# Altium project Sampler_DIOT.PrjPCB (part 2 of 5)

## Sheet EEM_Connectors.SchDoc
size 420 x 297 mm; EDA_Number: ARTIQ; CompanyName: WUT ISE; Organization: WUT ISE; DocumentNumber: 5; SheetNumber: 11; Title2: EEM Connectors, JTAG switches; SPICEModelCacheVGBTAUBO: <root> / <DocumentId>VGBTAUBO</DocumentId> / <CacheFrame Number="0"> / <Model Name="pk14" Kind="CKT"> / <Text>*.INC dhvqfn.s / .SUBCKT pk14 / +    1   2   3   4   5   6   7   8   9  10 / +   11  12  13  14 / +   15  16  17  18  19  20  21  22  23  24 / +   25  26  27  28 / * Pin Resistance / r1 1 1001 9.078E-02 / r2 2 1002 8.829E-02 / r3 3 1003 8.731E-02 / r4 4 1004 8.710E-02 / r5 5 1005 8.731E-02 / r6 6 1006 8.829E-02 / r7 7 1007 9.075E-02 / r8 8 1008 9.072E-02 / r9 9 1009 8.809E-02 / r10 10 1010 8.716E-02 / r11 11 1011 8.706E-02 / r12 12 1012 8.720E-02 / r13 13 1013 8.816E-02 / r14 14 1014 9.068E-02 / * Pin Inductance / l1 1001 15 2.981E-09 / l2 1002 16 2.447E-09 / l3 1003 17 2.304E-09 / l4 1004 18 2.291E-09 / l5 1005 19 2.307E-09 / l6 1006 20 2.449E-09 / l7 1007 21 2.971E-09 / l8 1008 22 2.972E-09 / l9 1009 23 2.425E-09 / l10 1010 24 2.286E-09 / l11 1011 25 2.280E-09 / l12 1012 26 2.286E-09 / l13 1013 27 2.425E-09 / l14 1014 28 2.975E-09 / .ENDS pk14</Text> / </Model> / </CacheFrame> / </root>; ModifiedDate: -; ProjectName: Sampler_DIOT.PrjPCB
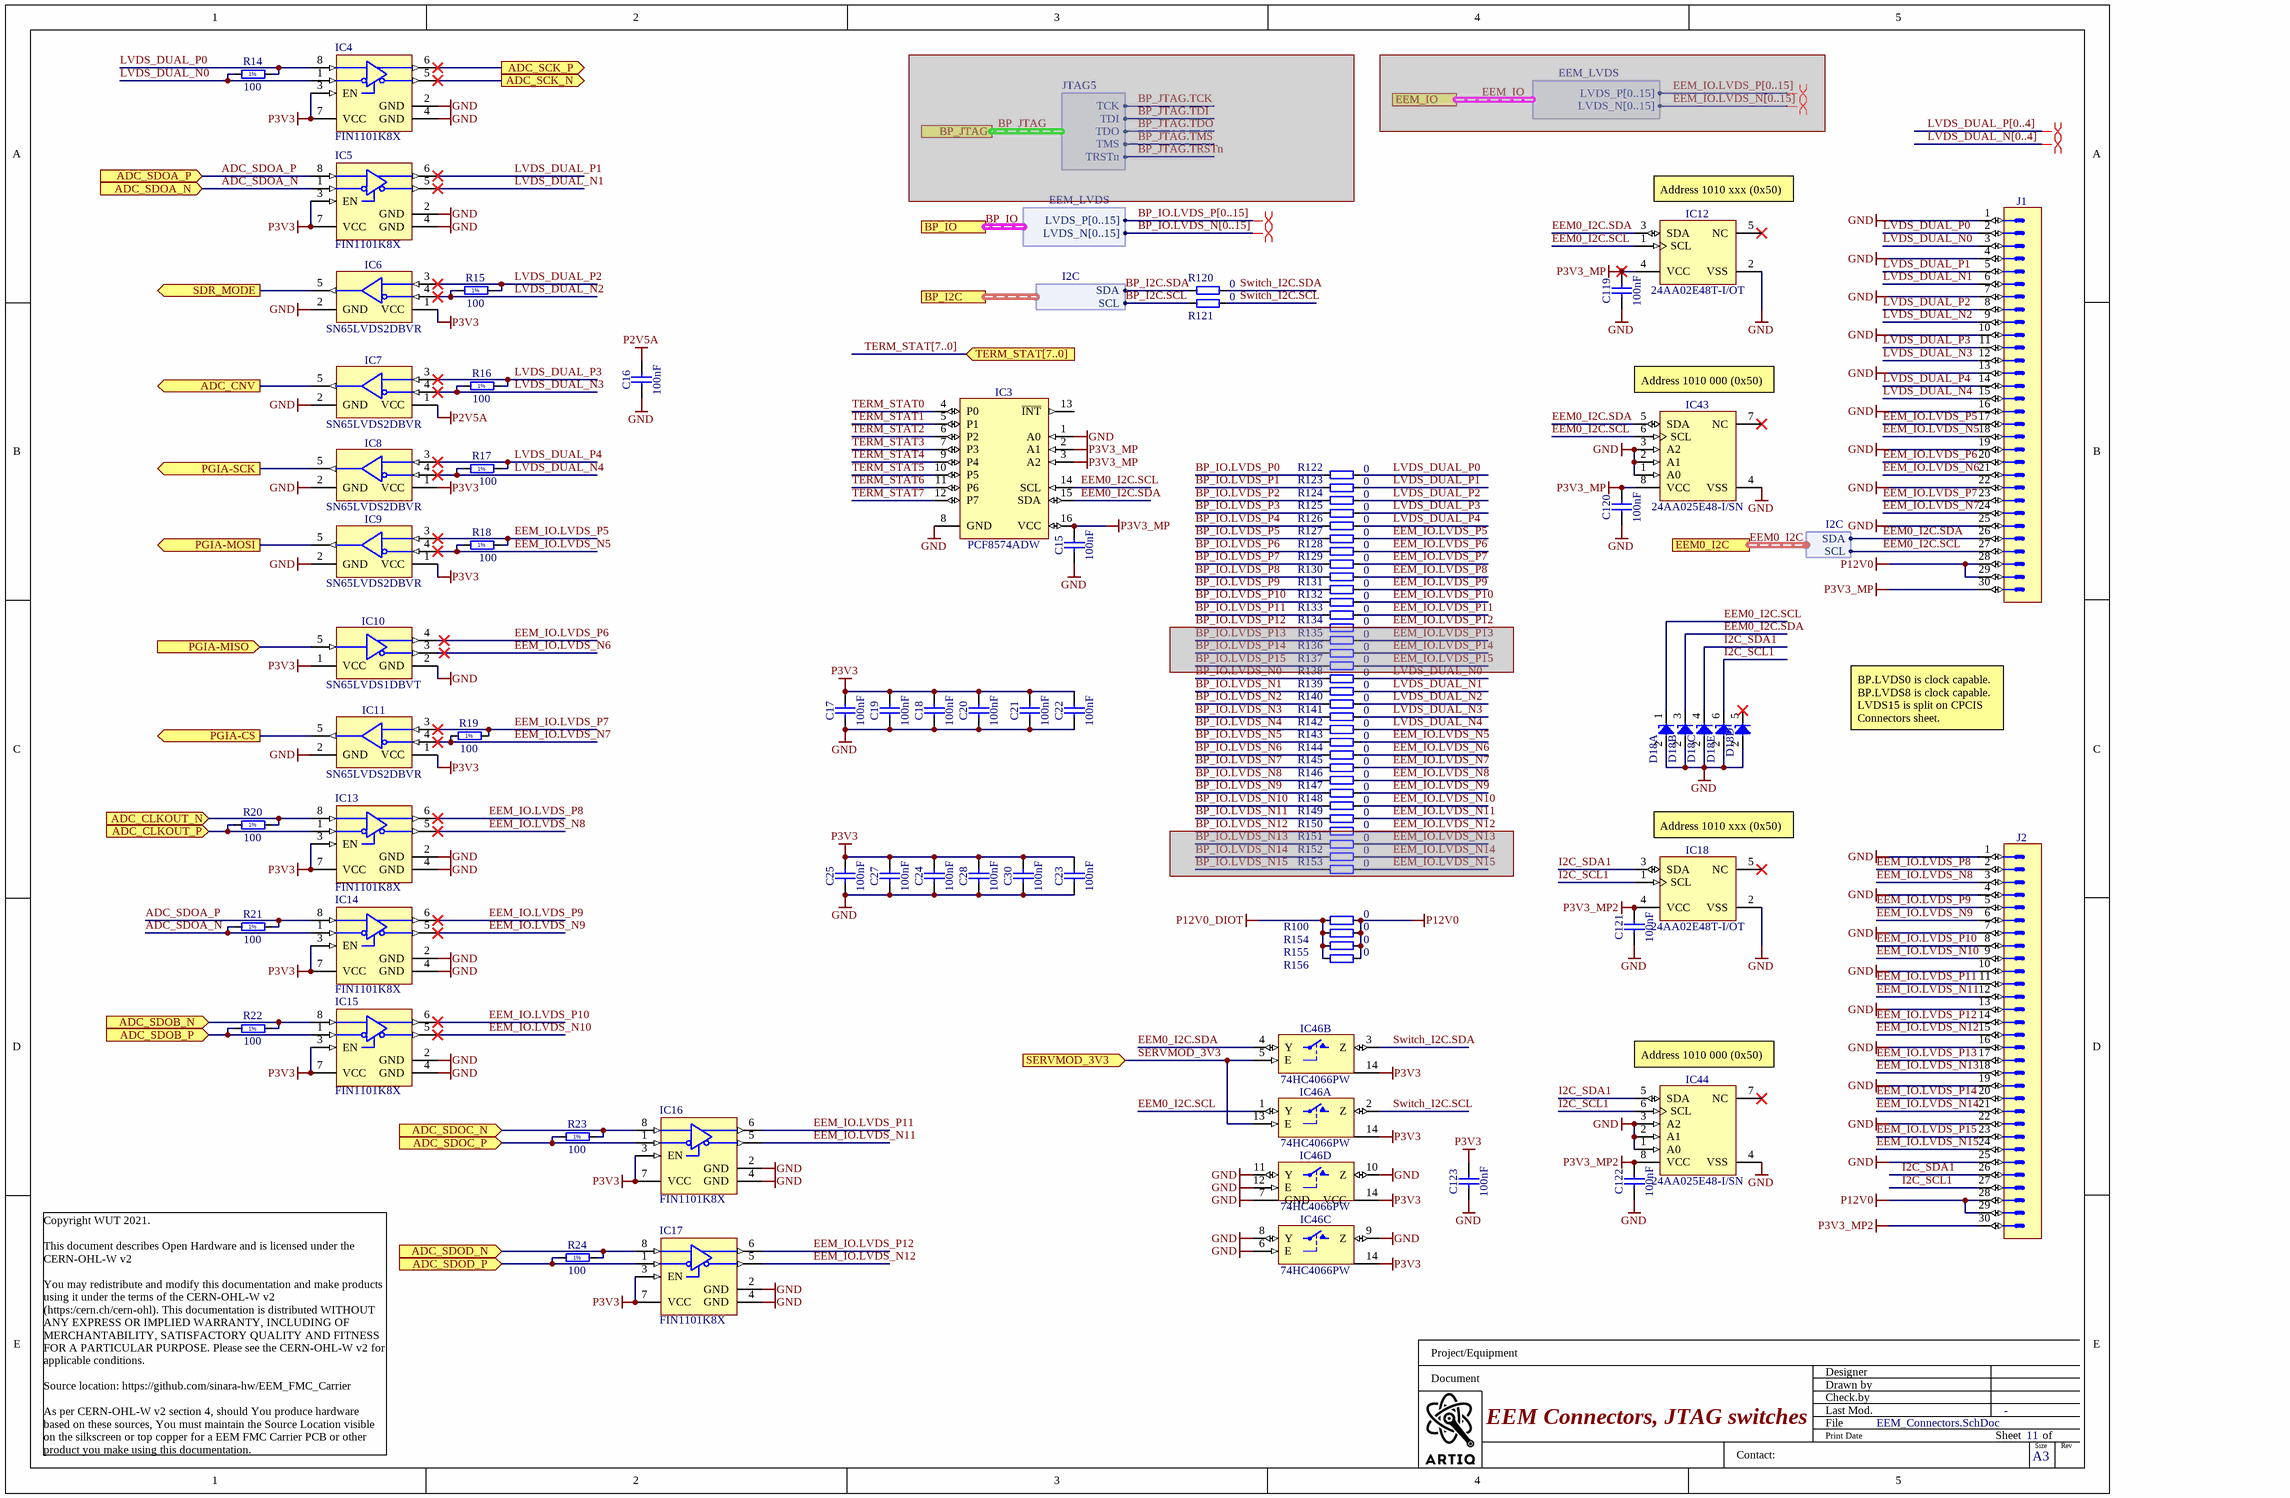
[diagram p2: EEM_Connectors.SchDoc]

### Parts
C15  100nF  [CAPC1005X55N]
C16  100nF  [CAPC1005X55N]
C17  100nF  [CAPC1005X55N]
C18  100nF  [CAPC1005X55N]
C19  100nF  [CAPC1005X55N]
C20  100nF  [CAPC1005X55N]
C21  100nF  [CAPC1005X55N]
C22  100nF  [CAPC1005X55N]
C23  100nF  [CAPC1005X55N]
C24  100nF  [CAPC1005X55N]
C25  100nF  [CAPC1005X55N]
C27  100nF  [CAPC1005X55N]
C28  100nF  [CAPC1005X55N]
C30  100nF  [CAPC1005X55N]
C119  100nF  [CAPC1005X55N]
C120  100nF  [CAPC1005X55N]
C121  100nF  [CAPC1005X55N]
C122  100nF  [CAPC1005X55N]
C123  100nF  [CAPC1005X55N]
D18  PESD3V3L5UY  [SOT65P210X110-6N]  (value not drawn)  (parts A,B,C,D,E of 5)
IC3  PCF8574ADW  [SOIC127P1030X265-16N]
IC4  FIN1101K8X  [SOP50P310X90-8N]
IC5  FIN1101K8X  [SOP50P310X90-8N]
IC6  SN65LVDS2DBVR  [SOT95P280X145-5N]
IC7  SN65LVDS2DBVR  [SOT95P280X145-5N]
IC8  SN65LVDS2DBVR  [SOT95P280X145-5N]
IC9  SN65LVDS2DBVR  [SOT95P280X145-5N]
IC10  SN65LVDS1DBVT  [SOT95P280X145-5N]
IC11  SN65LVDS2DBVR  [SOT95P280X145-5N]
IC12  24AA02E48T-I/OT  [SOT95P280X145-5N]
IC13  FIN1101K8X  [SOP50P310X90-8N]
IC14  FIN1101K8X  [SOP50P310X90-8N]
IC15  FIN1101K8X  [SOP50P310X90-8N]
IC16  FIN1101K8X  [SOP50P310X90-8N]
IC17  FIN1101K8X  [SOP50P310X90-8N]
IC18  24AA02E48T-I/OT  [SOT95P280X145-5N]
IC43  24AA025E48-I/SN  [SOIC127P600X175-8N]
IC44  24AA025E48-I/SN  [SOIC127P600X175-8N]
IC46  74HC4066PW  [SOP65P640X110-14N]  (parts A,B,C,D of 4)
J1  (no value)  [3M_N2530-6002RB]
J2  (no value)  [3M_N2530-6002RB]
R14  100  [RESC1005X40N]
R15  100  [RESC1005X40N]
R16  100  [RESC1005X40N]
R17  100  [RESC1005X40N]
R18  100  [RESC1005X40N]
R19  100  [RESC1005X40N]
R20  100  [RESC1005X40N]
R21  100  [RESC1005X40N]
R22  100  [RESC1005X40N]
R23  100  [RESC1005X40N]
R24  100  [RESC1005X40N]
R100  0  [RESC1005X40N]
R120  0  [RESC1005X40N]
R121  0  [RESC1005X40N]
R122  0  [RESC1005X40N]
R123  0  [RESC1005X40N]
R124  0  [RESC1005X40N]
R125  0  [RESC1005X40N]
R126  0  [RESC1005X40N]
R127  0  [RESC1005X40N]
R128  0  [RESC1005X40N]
R129  0  [RESC1005X40N]
R130  0  [RESC1005X40N]
R131  0  [RESC1005X40N]
R132  0  [RESC1005X40N]
R133  0  [RESC1005X40N]
R134  0  [RESC1005X40N]  (masked out: inside a compile mask, not in the netlist)
R135  0  [RESC1005X40N]  (masked out: inside a compile mask, not in the netlist)
R136  0  [RESC1005X40N]  (masked out: inside a compile mask, not in the netlist)
R137  0  [RESC1005X40N]  (masked out: inside a compile mask, not in the netlist)
R138  0  [RESC1005X40N]
R139  0  [RESC1005X40N]
R140  0  [RESC1005X40N]
R141  0  [RESC1005X40N]
R142  0  [RESC1005X40N]
R143  0  [RESC1005X40N]
R144  0  [RESC1005X40N]
R145  0  [RESC1005X40N]
R146  0  [RESC1005X40N]
R147  0  [RESC1005X40N]
R148  0  [RESC1005X40N]
R149  0  [RESC1005X40N]
R150  0  [RESC1005X40N]  (masked out: inside a compile mask, not in the netlist)
R151  0  [RESC1005X40N]  (masked out: inside a compile mask, not in the netlist)
R152  0  [RESC1005X40N]  (masked out: inside a compile mask, not in the netlist)
R153  0  [RESC1005X40N]  (masked out: inside a compile mask, not in the netlist)
R154  0  [RESC1005X40N]
R155  0  [RESC1005X40N]
R156  0  [RESC1005X40N]

### Ports
ADC_CLKOUT_N (in), ADC_CLKOUT_P (in), ADC_CNV (out), ADC_SCK_N (out), ADC_SCK_P (out), ADC_SDOA_N (in), ADC_SDOA_P (in), ADC_SDOB_N (in), ADC_SDOB_P (in), ADC_SDOC_N (in), ADC_SDOC_P (in), ADC_SDOD_N (in), ADC_SDOD_P (in), BP_I2C (harness I2C), BP_IO (harness EEM_LVDS), BP_JTAG (harness JTAG5), EEM0_I2C (harness I2C), EEM_IO (harness EEM_LVDS), PGIA-CS (out), PGIA-MISO (in), PGIA-MOSI (out), PGIA-SCK (out), SDR_MODE (out), SERVMOD_3V3 (in), TERM_STAT[7..0] (in)

### Harnesses
JTAG5: TCK, TDI, TDO, TMS, TRSTn
I2C: SDA, SCL
EEM_LVDS: LVDS_P[0..15], LVDS_N[0..15]

### Nets
GND: C15.1 C16.1 C17.1 C18.1 C19.1 C20.1 C21.1 C22.1 C23.1 C24.1 C25.1 C27.1 C28.1 C30.1 C119.1 C120.1 C121.1 C122.1 C123.1 D18.2(A) IC3.1(A0) IC3.8(GND) IC4.2(GND) IC4.4(GND) IC5.2(GND) IC5.4(GND) IC6.2(GND) IC7.2(GND) IC8.2(GND) IC9.2(GND) IC10.2(GND) IC11.2(GND) IC12.2(VSS) IC13.2(GND) IC13.4(GND) IC14.2(GND) IC14.4(GND) IC15.2(GND) IC15.4(GND) IC16.2(GND) IC16.4(GND) IC17.2(GND) IC17.4(GND) IC18.2(VSS) IC43.1(A0) IC43.2(A1) IC43.3(A2) IC43.4(VSS) IC44.1(A0) IC44.2(A1) IC44.3(A2) IC44.4(VSS) IC46.6(E) IC46.7(GND) IC46.8(Y) IC46.9(Z) IC46.10(Z) IC46.11(Y) IC46.12(E) J1.1 J1.4 J1.7 J1.10 J1.13 J1.16 J1.19 J1.22 J1.25 J2.1 J2.4 J2.7 J2.10 J2.13 J2.16 J2.19 J2.22 J2.25
P2V5A: C16.2 IC7.1(VCC)
P3V3: C17.2 C18.2 C19.2 C20.2 C21.2 C22.2 C23.2 C24.2 C25.2 C27.2 C28.2 C30.2 C123.2 IC4.3(EN) IC4.7(VCC) IC5.3(EN) IC5.7(VCC) IC6.1(VCC) IC8.1(VCC) IC9.1(VCC) IC10.1(VCC) IC11.1(VCC) IC13.3(EN) IC13.7(VCC) IC14.3(EN) IC14.7(VCC) IC15.3(EN) IC15.7(VCC) IC16.3(EN) IC16.7(VCC) IC17.3(EN) IC17.7(VCC) IC46.14(VCC)
P3V3_MP: C15.2 C119.2 C120.2 IC3.2(A1) IC3.3(A2) IC3.16(VCC) IC12.4(VCC) IC43.8(VCC) J1.30
P3V3_MP2: C121.2 C122.2 IC18.4(VCC) IC44.8(VCC) J2.30
P12V0: J1.28 J1.29 J2.28 J2.29 R100.2 R154.2 R155.2 R156.2
P12V0_DIOT: R100.1 R154.1 R155.1 R156.1
ADC_CLKOUT_N: IC13.8(RIN+) R20.2 ; port ADC_CLKOUT_N
ADC_CLKOUT_P: IC13.1(RIN-) R20.1 ; port ADC_CLKOUT_P
ADC_SCK_N: IC4.5(DOUT-) ; port ADC_SCK_N
ADC_SCK_P: IC4.6(DOUT+) ; port ADC_SCK_P
ADC_SDOA_N: IC5.1(RIN-) IC14.1(RIN-) R21.1 ; port ADC_SDOA_N
ADC_SDOA_P: IC5.8(RIN+) IC14.8(RIN+) R21.2 ; port ADC_SDOA_P
ADC_SDOB_N: IC15.8(RIN+) R22.2 ; port ADC_SDOB_N
ADC_SDOB_P: IC15.1(RIN-) R22.1 ; port ADC_SDOB_P
ADC_SDOC_N: IC16.8(RIN+) R23.2 ; port ADC_SDOC_N
ADC_SDOC_P: IC16.1(RIN-) R23.1 ; port ADC_SDOC_P
ADC_SDOD_N: IC17.8(RIN+) R24.2 ; port ADC_SDOD_N
ADC_SDOD_P: IC17.1(RIN-) R24.1 ; port ADC_SDOD_P
BP_I2C.SCL: R121.1 ; port BP_I2C.SCL
BP_I2C.SDA: R120.1 ; port BP_I2C.SDA
BP_IO.LVDS_N0: R138.1
BP_IO.LVDS_N1: R139.1
BP_IO.LVDS_N2: R140.1
BP_IO.LVDS_N3: R141.1
BP_IO.LVDS_N4: R142.1
BP_IO.LVDS_N5: R143.1
BP_IO.LVDS_N6: R144.1
BP_IO.LVDS_N7: R145.1
BP_IO.LVDS_N8: R146.1
BP_IO.LVDS_N9: R147.1
BP_IO.LVDS_N10: R148.1
BP_IO.LVDS_N11: R149.1
BP_IO.LVDS_P0: R122.1
BP_IO.LVDS_P1: R123.1
BP_IO.LVDS_P2: R124.1
BP_IO.LVDS_P3: R125.1
BP_IO.LVDS_P4: R126.1
BP_IO.LVDS_P5: R127.1
BP_IO.LVDS_P6: R128.1
BP_IO.LVDS_P7: R129.1
BP_IO.LVDS_P8: R130.1
BP_IO.LVDS_P9: R131.1
BP_IO.LVDS_P10: R132.1
BP_IO.LVDS_P11: R133.1
EEM0_I2C.SCL: D18.1(C) IC3.14(SCL) IC12.1(SCL) IC43.6(SCL) IC46.1(Y) J1.27 ; port EEM0_I2C.SCL
EEM0_I2C.SDA: D18.3(C) IC3.15(SDA) IC12.3(SDA) IC43.5(SDA) IC46.4(Y) J1.26 ; port EEM0_I2C.SDA
EEM_IO.LVDS_N5: IC9.4(B) J1.18 R18.1 R143.2
EEM_IO.LVDS_N6: IC10.3(A) J1.21 R144.2
EEM_IO.LVDS_N7: IC11.4(B) J1.24 R19.1 R145.2
EEM_IO.LVDS_N8: IC13.5(DOUT-) J2.3 R146.2
EEM_IO.LVDS_N9: IC14.5(DOUT-) J2.6 R147.2
EEM_IO.LVDS_N10: IC15.5(DOUT-) J2.9 R148.2
EEM_IO.LVDS_N11: IC16.5(DOUT-) J2.12 R149.2
EEM_IO.LVDS_N12: IC17.5(DOUT-) J2.15
EEM_IO.LVDS_N13: J2.18
EEM_IO.LVDS_N14: J2.21
EEM_IO.LVDS_N15: J2.24
EEM_IO.LVDS_P5: IC9.3(A) J1.17 R18.2 R127.2
EEM_IO.LVDS_P6: IC10.4(B) J1.20 R128.2
EEM_IO.LVDS_P7: IC11.3(A) J1.23 R19.2 R129.2
EEM_IO.LVDS_P8: IC13.6(DOUT+) J2.2 R130.2
EEM_IO.LVDS_P9: IC14.6(DOUT+) J2.5 R131.2
EEM_IO.LVDS_P10: IC15.6(DOUT+) J2.8 R132.2
EEM_IO.LVDS_P11: IC16.6(DOUT+) J2.11 R133.2
EEM_IO.LVDS_P12: IC17.6(DOUT+) J2.14
EEM_IO.LVDS_P13: J2.17
EEM_IO.LVDS_P14: J2.20
EEM_IO.LVDS_P15: J2.23
I2C_SCL1: D18.6(C) IC18.1(SCL) IC44.6(SCL) J2.27
I2C_SDA1: D18.4(C) IC18.3(SDA) IC44.5(SDA) J2.26
LVDS_DUAL_N0: IC4.1(RIN-) J1.3 R14.1 R138.2
LVDS_DUAL_N1: IC5.5(DOUT-) J1.6 R139.2
LVDS_DUAL_N2: IC6.4(B) J1.9 R15.1 R140.2
LVDS_DUAL_N3: IC7.4(B) J1.12 R16.1 R141.2
LVDS_DUAL_N4: IC8.4(B) J1.15 R17.1 R142.2
LVDS_DUAL_P0: IC4.8(RIN+) J1.2 R14.2 R122.2
LVDS_DUAL_P1: IC5.6(DOUT+) J1.5 R123.2
LVDS_DUAL_P2: IC6.3(A) J1.8 R15.2 R124.2
LVDS_DUAL_P3: IC7.3(A) J1.11 R16.2 R125.2
LVDS_DUAL_P4: IC8.3(A) J1.14 R17.2 R126.2
PGIA-CS: IC11.5(R) ; port PGIA-CS
PGIA-MISO: IC10.5(R) ; port PGIA-MISO
PGIA-MOSI: IC9.5(R) ; port PGIA-MOSI
PGIA-SCK: IC8.5(R) ; port PGIA-SCK
SDR_MODE: IC6.5(R) ; port SDR_MODE
SERVMOD_3V3: IC46.5(E) IC46.13(E) ; port SERVMOD_3V3
Switch_I2C.SCL: IC46.2(Z) R121.2
Switch_I2C.SDA: IC46.3(Z) R120.2
TERM_STAT0: IC3.4(P0)
TERM_STAT1: IC3.5(P1)
TERM_STAT2: IC3.6(P2)
TERM_STAT3: IC3.7(P3)
TERM_STAT4: IC3.9(P4)
TERM_STAT5: IC3.10(P5)
TERM_STAT6: IC3.11(P6)
TERM_STAT7: IC3.12(P7)
NetIC7_5: IC7.5(R) ; port ADC_CNV

Not connected (* = marked no-connect by the designer): D18 5(C)*; IC3 13(~{INT}); IC12 5(NC)*; IC18 5(NC)*; IC43 7(NC)*; IC44 7(NC)*

### Buses and harness runs
bus BP_IO.LVDS_N[0..15]
bus BP_IO.LVDS_P[0..15]
bus LVDS_DUAL_N[0..4]
bus LVDS_DUAL_P[0..4]
bus TERM_STAT[7..0] = port TERM_STAT[7..0]
harness BP_IO = port BP_IO
harness EEM0_I2C = port EEM0_I2C

### Layout directives
differential pair; differential pair class Diff_100Ohm: (no net found under the mark)

### Notes on the sheet
- (near IC12) Address 1010 xxx (0x50)
- (near IC43) Address 1010 000 (0x50)
- BP.LVDS0 is clock capable.
  BP.LVDS8 is clock capable.
  LVDS15 is split on CPCIS Connectors sheet.
- (near IC18) Address 1010 xxx (0x50)
- (near IC44) Address 1010 000 (0x50)
- Project/Equipment
- Document
- Designer
- Drawn by
- Check.by
- Copyright WUT 2021.
  This document describes Open Hardware and is licensed under the CERN-OHL-W v2
  You may redistribute and modify this documentation and make products using it under the terms of the CERN-OHL-W v2 (https:/cern.ch/cern-ohl). This documentation is distributed WITHOUT ANY EXPRESS OR IMPLIED WARRANTY, INCLUDING OF MERCHANTABILITY, SATISFACTORY QUALITY AND FITNESS FOR A PARTICULAR PURPOSE. Please see the CERN-OHL-W v2 for applicable conditions.
  Source location: https://github.com/sinara-hw/EEM_FMC_Carrier
  As per CERN-OHL-W v2 section 4, should You produce hardware based on these sources, You must maintain the Source Location visible on the silkscreen or top copper for a EEM FMC Carrier PCB or other product you make using this documentation.
- Contact:
- File
- Last Mod.
- Print Date
- Sheet
- Size
- A3
- of
- Rev
- (in symbol R0402_100R_1%_0.1W_100PPM) 1%

### Library data of the parts
C15-C25 C27 C28 C30 C122 C123 = CC0402_100NF_16V_10%_X5R: Non-polarised capacitor; Part Description: SMD Multilayer Chip Ceramic Capacitor; Manufacturer: GENERIC; Manufacturer1 Part Number: GRM155R61C104KA88D; Voltage: 16V; TC: X5R; Tolerance: ±10%; Part Number: CC0402_100NF_16V_10%_X5R; Component Kind: Standard; Component Type: Standard; Pin Count: 2; Value: 100nF; Status: None; Manufacturer Part Number: CC0402_100NF_16V_10%_X5R; Case: 0402; Mounted: Yes; Socket: No; SMD: Yes; Sense: No; Manufacturer1 Example: MURATA; Manufacturer1 ComponentHeight: 0.55mm; HelpURL: \\cern.ch\dfs\Applications\Altium\Datasheets\CC0402_X5R_MURATA_GRM.pdf; Author: CERN DEM JLC; CreateDate: 10.12.2013; LatestRevisionDate: 10.12.2013
C119-C121 = CC0402_100NF_25V_10%_X7R_YUDEN_TMK105B7104KVHF: Non-polarised capacitor; Part Description: SMD Multilayer Chip Ceramic Capacitor (High Dielectric Type) for Automotive / Industrial Applications; Manufacturer: TAIYO YUDEN; Voltage: 25V; TC: X7R; Tolerance: ±10%; Part Number: CC0402_100NF_25V_10%_X7R_YUDEN_TMK105B7104KVHF; Component Kind: Standard; Component Type: Standard; Pin Count: 2; Value: 100nF; Status: Not Recommended; Manufacturer Part Number: TMK105B7104KVHF; Case: 0402; Mounted: Yes; Socket: No; SMD: Yes; Sense: No; HelpURL: \\cern.ch\dfs\Applications\Altium\Datasheets\CC0402_TAIYO-YUDEN_TMK105B7104KVHF.pdf; Author: CERN DEM JLC; CreateDate: 10-May-17; LatestRevisionDate: 10-May-17; ComponentHeight: 0.55mm
D18 = PESD3V3L5UY: Fivefold ESD Protection Diode Arrays; Part Description: Fivefold ESD Protection Diode Arrays (30kV); Manufacturer: NEXPERIA; Voltage: 3.3V; Power: 200W; PressFit: No; Bonding: No; Part Number: PESD3V3L5UY; Component Kind: Standard; Component Type: Standard; Device: PESD3V3L5UY; PackageDescription: SOT363, SC-88, 0.65mm Pitch; 6 Pin, 1.25mm W X 2.00mm L X 1.10mm H body, IPC Medium Density; Manufacturer Part Number: PESD3V3L5UY; Pin Count: 6; Case: SOT363; Mounted: Yes; Socket: No; SMD: Yes; Sense: No; ComponentHeight: 1.1mm; HelpURL: \\cern.ch\dfs\Applications\Altium\Datasheets\PESD3V3L5UY.pdf; Author: CERN DEM WB; CreateDate: 05.07.2021; LatestRevisionDate: 05.07.2021
IC3 = PCF8574ADW: Remote 8-bit I/O Expander For I2C Bus; Manufacturer: TEXAS INSTRUMENTS; PressFit: No; Bonding: No; Part Number: PCF8574ADW; Component Kind: Standard; Component Type: Standard; Device: PCF8574ADW; PackageDescription: SOIC 16, Pitch 1.27mm - Body 7.5x10.3mm, IPC Medium Density; Part Description: Remote 8-bit I/O Expander For I2C Bus; Manufacturer Part Number: PCF8574ADW; Pin Count: 16; Case: SOIC16W; Mounted: Yes; Socket: No; SMD: Yes; Sense: No; ComponentHeight: 2.65mm; Author: CERN DEM JLC; HelpURL: \\cern.ch\dfs\Applications\Altium\Datasheets\PCF8574ADW.pdf; CreateDate: 01.11.2012; LatestRevisionDate: 01.11.2012
IC4 IC5 IC13-IC17 = FIN1101K8X: LVDS Single Port High Speed Repeater; Manufacturer: FAIRCHILD SEMICONDUCTOR; PressFit: No; Bonding: No; Part Number: FIN1101K8X; Component Kind: Standard; Component Type: Standard; Device: FIN1101K8X; PackageDescription: SOP, 0.50mm Pitch; 8 pin, 2.30mm W X 2.00mm L X 0.90mm H body, PC Medium Density; Part Description: LVDS Single Port High Speed Repeater; Manufacturer Part Number: FIN1101K8X; Pin Count: 8; Case: TSSOP8; Mounted: Yes; Socket: No; SMD: Yes; Sense: No; ComponentHeight: 0.8mm; Author: CERN DEM JLC; HelpURL: \\cern.ch\dfs\Applications\Altium\Datasheets\FIN1101K8X.pdf; CreateDate: 08.11.2016; LatestRevisionDate: 08.11.2016
IC6-IC9 IC11 = SN65LVDS2DBVR: High-Speed Differential Line Receiver; Manufacturer: TEXAS INSTRUMENTS; PressFit: No; Bonding: No; Part Number: SN65LVDS2DBVR; Component Kind: Standard; Component Type: Standard; Device: SN65LVDS2DBVR; PackageDescription: SOT, 0.95mm pitch; 5 pin, 1.60mm W X 2.90mm L X 1.45mm H body, IPC Medium Density; Part Description: High-Speed Differential Line Receiver; Manufacturer Part Number: SN65LVDS2DBVR; Pin Count: 5; Case: SOT23-5; Mounted: Yes; Socket: No; SMD: Yes; Sense: No; ComponentHeight: 1.45mm; Author: CERN DEM JLC; HelpURL: \\cern.ch\dfs\Applications\Altium\Datasheets\SN65LVDS2DBVR.pdf; CreateDate: 03.03.2011; LatestRevisionDate: 22.09.2011
IC10 = SN65LVDS1DBVT: High-Speed Differential Line Driver; Manufacturer: TEXAS INSTRUMENTS; PressFit: No; Bonding: No; Part Number: SN65LVDS1DBVT; Component Kind: Standard; Component Type: Standard; Device: SN65LVDS1DBVT; PackageDescription: SOT, 0.95mm pitch; 5 pin, 1.60mm W X 2.90mm L X 1.45mm H body, IPC Medium Density; Part Description: High-Speed Differential Line Driver; Manufacturer Part Number: SN65LVDS1DBVT; Pin Count: 5; Case: SOT23-5; Mounted: Yes; Socket: No; SMD: Yes; Sense: No; ComponentHeight: 1.45mm; Author: CERN DEM JLC; HelpURL: \\cern.ch\dfs\Applications\Altium\Datasheets\SN65LVDS1DBVT.pdf; CreateDate: 22.09.2011; LatestRevisionDate: 22.09.2011
IC12 IC18 = 24AA02E48T-I/OT: 1.7V-5.5V, 2K I2C Serial EEPROM With EUI-48 Node Identity; Manufacturer: MICROCHIP TECHNOLOGY; PressFit: No; Bonding: No; Part Number: 24AA02E48T-I/OT; Component Kind: Standard; Component Type: Standard; Device: 24AA02E48T-I/OT; PackageDescription: SOT, 0.95mm pitch; 5 pin, 1.60mm W X 2.90mm L X 1.45mm H body, IPC Medium Density; Part Description: 1.7V-5.5V, 2K I2C Serial EEPROM with EUI-48 Node Identity; Manufacturer Part Number: 24AA02E48T-I/OT; Pin Count: 5; Case: SOT23-5; Mounted: Yes; Socket: No; SMD: Yes; Sense: No; ComponentHeight: 1.45mm; HelpURL: \\cern.ch\dfs\Applications\Altium\Datasheets\24AA02E48T-I-OT.pdf; Author: CERN DEM MR; CreateDate: 31.03.2016; LatestRevisionDate: 31.03.2016
IC43 IC44 = 24AA025E48-I/SN: 1.7V-5.5V, 2K I2C™ Serial EEPROMs with EUI-48™ Node Identity; Manufacturer: MICROCHIP TECHNOLOGY; PressFit: No; Bonding: No; Part Number: 24AA025E48-I/SN; Component Kind: Standard; Component Type: Standard; Device: 24AA025E48-I/SN; PackageDescription: SOIC 8, Pitch 1.27mm - Body 4x5mm, IPC Medium Density; Part Description: 1.7V-5.5V, 2K I2C™ Serial EEPROMs with EUI-48™ Node Identity; Manufacturer Part Number: 24AA025E48-I/SN; Pin Count: 8; Case: SOIC8; Mounted: Yes; Socket: No; SMD: Yes; Sense: No; ComponentHeight: 1.75mm; HelpURL: \\cern.ch\dfs\Applications\Altium\Datasheets\24AA025E48-I-SN.pdf; Author: CERN DEM MR; CreateDate: 19.07.2016; LatestRevisionDate: 19.07.2016
IC46 = 74HC4066PW: Part Description: Quad Single-Pole Single-Throw Analog Switch; Manufacturer: NXP SEMICONDUCTORS; PressFit: No; Bonding: No; Table: Standard Logic; Part Number: 74HC4066PW; Component Kind: Standard; Component Type: Standard; Device: 74HC4066PW; PackageDescription: SOP, 14-Leads, Body 4.4x5mm (max), Pitch 0.65mm, IPC Medium Density; Manufacturer Part Number: 74HC4066PW; Pin Count: 14; Case: TSSOP14; Mounted: Yes; Socket: No; SMD: Yes; ComponentHeight: 1.1mm; Author: CERN DEM JLC; HelpURL: \\cern.ch\dfs\Applications\Altium\Datasheets\74HC4066PW.pdf; CreateDate: 2014-11-19; LatestRevisionDate: 2014-11-19
J1 J2 = 3M_N2530-6002RB: Connector 30 Male; Part Description: 30 Contacts - Straight .100'' x .100'' Low Profile Four-Wall Header, 2500 Series; Manufacturer: 3M; PressFit: No; Part Number: 3M_N2530-6002RB; Component Kind: Standard; Component Type: Standard; Pin Count: 30; Family: Header 30; Mounted: Yes; Socket: No; SMD: No; Sense: No; Status: None; Manufacturer Part Number: N2530-6002RB; ComponentHeight: 10.03mm; HelpURL: \\cern.ch\dfs\Applications\Altium\Datasheets\3M_N2530-6002RB.pdf; Author: CERN DEM JLC; CreateDate: 11.02.2009; LatestRevisionDate: 11.08.2009
R14-R24 = R0402_100R_1%_0.1W_100PPM: Resistor - 1%; Part Description: General Purpose Thick Film Chip Resistor; Manufacturer: GENERIC; Manufacturer Part Number: R0402_100R_1%_0.1W_100PPM_50V; Manufacturer1 Part Number: ERJ2RKF1000X; Power: 0.1W; TC: ±100ppm/°C; Voltage: 50V; Part Number: R0402_100R_1%_0.1W_100PPM; Component Kind: Standard; Component Type: Standard; Pin Count: 2; Value: 100; Status: Not recommended; Tolerance: ±1%; Case: 0402; Mounted: Yes; Sense: No; Socket: No; SMD: Yes; Manufacturer1 Example: PANASONIC; Manufacturer1 ComponentHeight: 0.4mm; HelpURL: \\cern.ch\dfs\Applications\Altium\Datasheets\R0402_PANASONIC_ERJ2RK.pdf; Author: CERN DEM JLC; CreateDate: 12.12.2013; LatestRevisionDate: 03.03.2015
R100 R120-R156 = R0402_0R_JUMPER: Resistor; Part Description: 1A (0.05R Max DC Resistance) Zero Ohm Jumper; Manufacturer: GENERIC; Manufacturer1 Part Number: 232270591001L; PressFit: No; Part Number: R0402_0R_JUMPER; Component Kind: Standard; Component Type: Standard; Pin Count: 2; Value: 0; Status: Not Recommended; Manufacturer Part Number: R0402_0R_JUMPER; Case: 0402; Mounted: Yes; Sense: No; Socket: No; SMD: Yes; Manufacturer1 Example: YAGEO PHYCOMP; Manufacturer1 ComponentHeight: 0.4mm; HelpURL: \\cern.ch\dfs\Applications\Altium\Datasheets\R0402_Phycomp_RC0402.pdf; Author: CERN DEM JLC; CreateDate: 03.12.2007; LatestRevisionDate: 17.10.2012